# Altium schematic sheet emmc.SchDoc
size A4; SheetNumber: 2; SheetTotal: 5
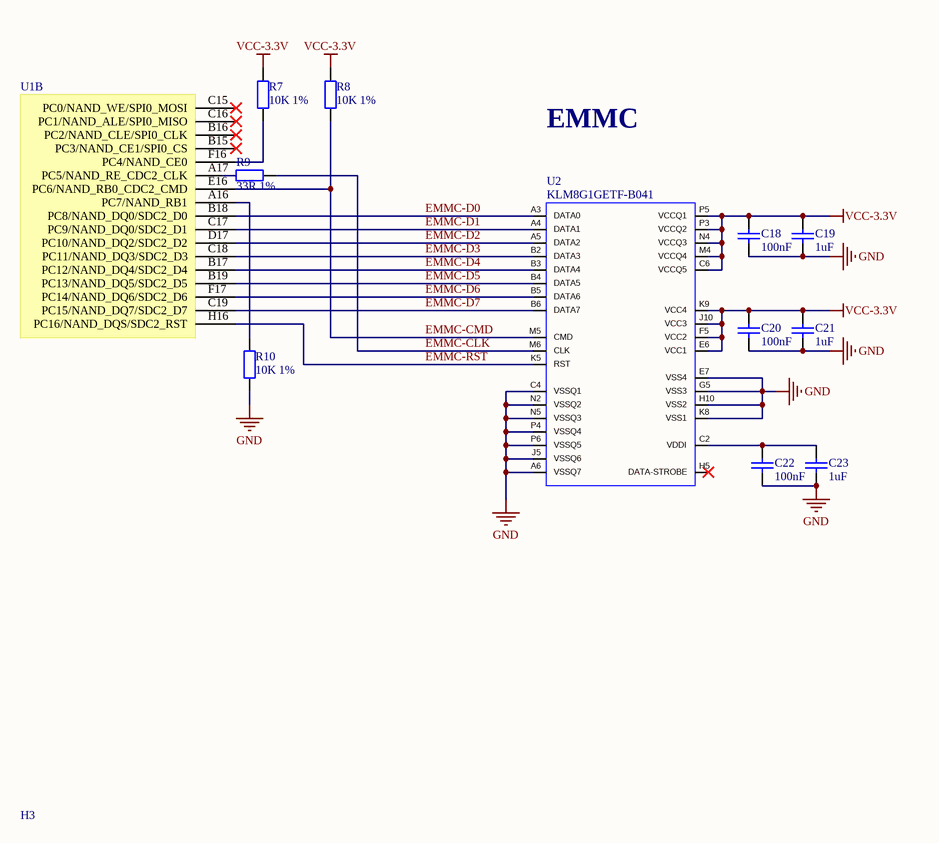
[diagram p0: emmc.SchDoc]

## Parts
C18  100nF  [0402_C]
C19  1uF  [0402_C]
C20  100nF  [0402_C]
C21  1uF  [0402_C]
C22  100nF  [0402_C]
C23  1uF  [0402_C]
R7  10K 1%  [0402_R]
R8  10K 1%  [0402_R]
R9  33R 1%  [0402_R]
R10  10K 1%  [0402_R]
U1  H3  [allwinner-h3]  (part B of 9)
U2  KLM8G1GETF-B041  [KLM8G1GETF-B041]

## Nets
GND: C18.2 C19.2 C20.2 C21.2 C22.2 C23.2 R10.2 U2.A6(VSSQ7) U2.C4(VSSQ1) U2.E7(VSS4) U2.G5(VSS3) U2.H10(VSS2) U2.J5(VSSQ6) U2.K8(VSS1) U2.N2(VSSQ2) U2.N5(VSSQ3) U2.P4(VSSQ4) U2.P6(VSSQ5)
VCC-3.3V: C18.1 C19.1 C20.1 C21.1 R7.1 R8.1 U2.C6(VCCQ5) U2.E6(VCC1) U2.F5(VCC2) U2.J10(VCC3) U2.K9(VCC4) U2.M4(VCCQ4) U2.N4(VCCQ3) U2.P3(VCCQ2) U2.P5(VCCQ1)
EMMC-CLK: R9.2 U2.M6(CLK)
EMMC-CMD: R8.2 U1.E16(PC6/NAND_RB0_CDC2_CMD) U2.M5(CMD)
EMMC-D0: U1.B18(PC8/NAND_DQ0/SDC2_D0) U2.A3(DATA0)
EMMC-D1: U1.C17(PC9/NAND_DQ0/SDC2_D1) U2.A4(DATA1)
EMMC-D2: U1.D17(PC10/NAND_DQ2/SDC2_D2) U2.A5(DATA2)
EMMC-D3: U1.C18(PC11/NAND_DQ3/SDC2_D3) U2.B2(DATA3)
EMMC-D4: U1.B17(PC12/NAND_DQ4/SDC2_D4) U2.B3(DATA4)
EMMC-D5: U1.B19(PC13/NAND_DQ5/SDC2_D5) U2.B4(DATA5)
EMMC-D6: U1.F17(PC14/NAND_DQ6/SDC2_D6) U2.B5(DATA6)
EMMC-D7: U1.C19(PC15/NAND_DQ7/SDC2_D7) U2.B6(DATA7)
EMMC-RST: U1.H16(PC16/NAND_DQS/SDC2_RST) U2.K5(RST)
NetC22_1: C22.1 C23.1 U2.C2(VDDI)
NetR7_2: R7.2 U1.F16(PC4/NAND_CE0)
NetR9_1: R9.1 U1.A17(PC5/NAND_RE_CDC2_CLK)
NetR10_1: R10.1 U1.A16(PC7/NAND_RB1)

Not connected (* = marked no-connect by the designer): U1 B15(PC3/NAND_CE1/SPI0_CS)* B16(PC2/NAND_CLE/SPI0_CLK)* C15(PC0/NAND_WE/SPI0_MOSI)* C16(PC1/NAND_ALE/SPI0_MISO)*; U2 H5(DATA-STROBE)*

## Notes on the sheet
- EMMC

## Library data of the parts
C18-C23 = CAP-SMD: smd capacitor
R7-R10 = RES-SMD: smd resistor
U1 = H3_CPU: CPU
U2 = KLM8G1GEND-B031: EMMC 8G